# Altium schematic sheet 3_Connectors.SchDoc
size A4
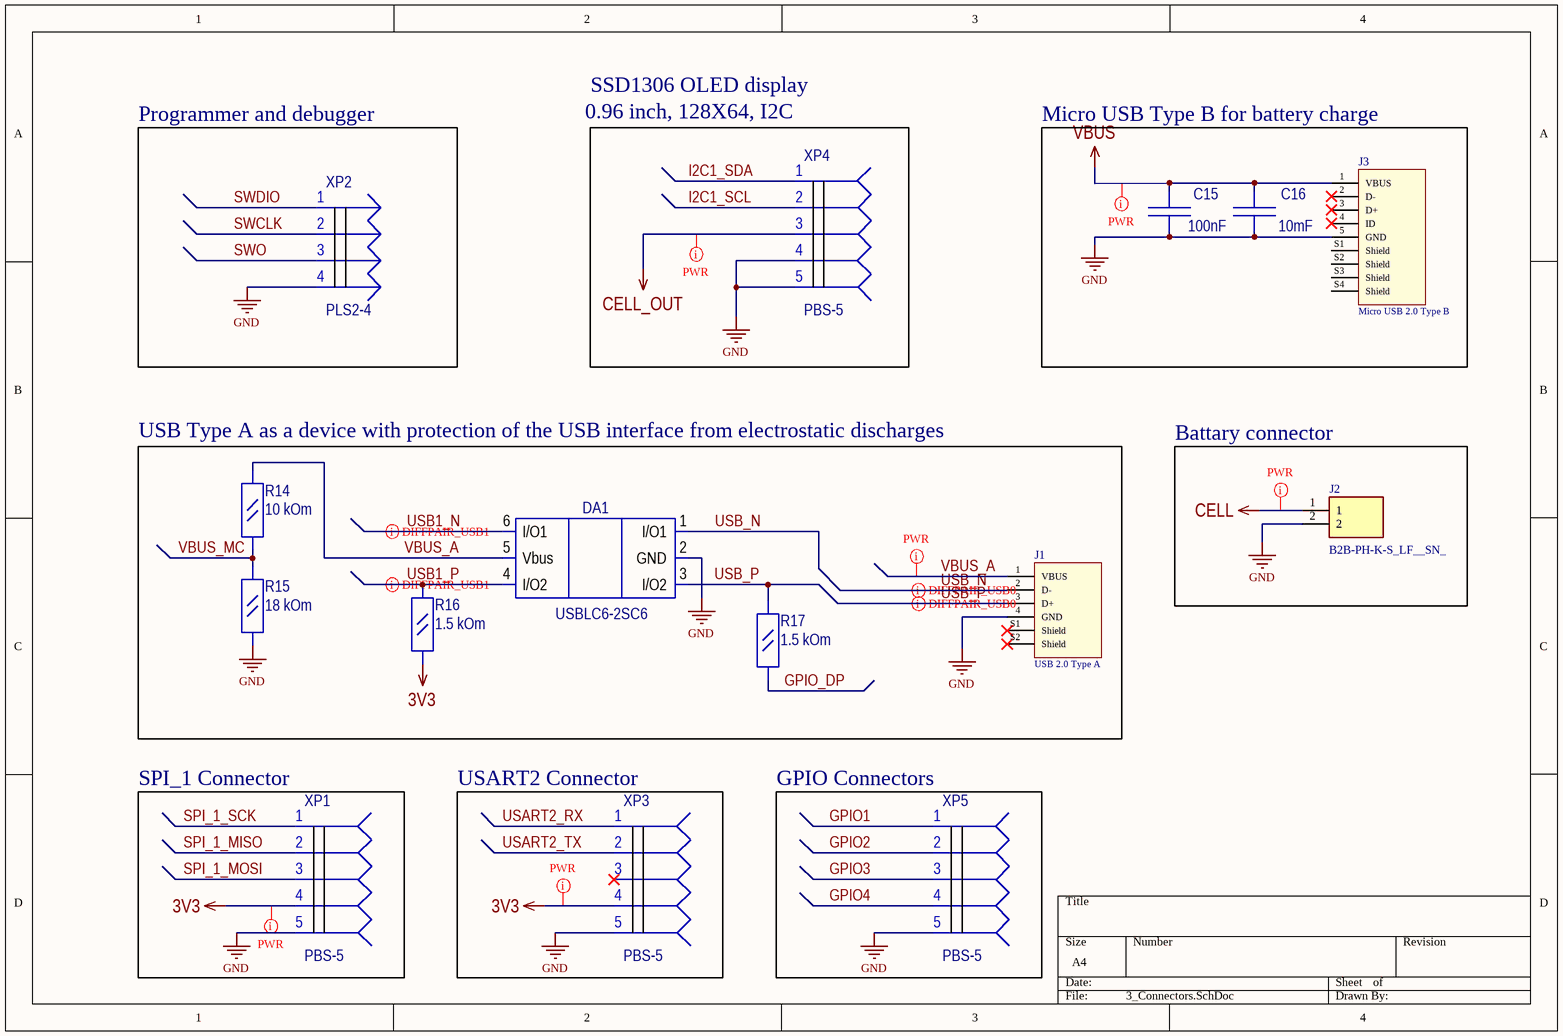
[diagram p0: 3_Connectors.SchDoc]

## Parts
C15  100nF  [C_0805]
C16  10mF  [C_0805]
DA1  USBLC6-2SC6  [SOT-23-6]
J1  USB 2.0 Type A  [61400416021]
J2  B2B-PH-K-S_LF__SN_  [SHDR2W50P0X200_1X2_590X450X600P]
J3  Micro USB 2.0 Type B  [629105136821]
R14  10 kOm  [R_0805]
R15  18 kOm  [R_0805]
R16  1.5 kOm  [R_0805]
R17  1.5 kOm  [R_0805]
XP1  PBS-5  [PBS-5]
XP2  PLS2-4  [PLS2-4]
XP3  PBS-5  [PBS-5]
XP4  PBS-5  [PBS-5]
XP5  PBS-5  [PBS-5]

## Blocks framed on the sheet
Programmer and debugger: XP2
Micro USB Type B for battery charge: C15 C16 J3
Battary connector: J2
SPI_1 Connector: XP1
USART2 Connector: XP3
GPIO Connectors: XP5

## Nets
3V3: R16.1 XP1.4 XP3.4
CELL: J2.1
CELL_OUT: XP4.3
GND: C15.1 C16.1 DA1.2(GND) J1.4(GND) J2.2 J3.5(GND) R15.1 XP1.5 XP2.4 XP3.5 XP4.4 XP4.5 XP5.5
VBUS: C15.2 C16.2 J3.1(VBUS)
GPIO1: XP5.1
GPIO2: XP5.2
GPIO3: XP5.3
GPIO4: XP5.4
GPIO_DP: R17.1
I2C1_SCL: XP4.2
I2C1_SDA: XP4.1
SPI_1_MISO: XP1.2
SPI_1_MOSI: XP1.3
SPI_1_SCK: XP1.1
SWCLK: XP2.2
SWDIO: XP2.1
SWO: XP2.3
USART2_RX: XP3.1
USART2_TX: XP3.2
USB1_N: DA1.6(I/O1)
USB1_P: DA1.4(I/O2) R16.2
USB_N: DA1.1(I/O1) J1.2(D-)
USB_P: DA1.3(I/O2) J1.3(D+) R17.2
VBUS_A: DA1.5(Vbus) J1.1(VBUS) R14.2
VBUS_MC: R14.1 R15.2

Not connected (* = marked no-connect by the designer): J1 S1(Shield)* S2(Shield)*; J3 2(D-)* 3(D+)* 4(ID)* S1(Shield) S2(Shield) S3(Shield) S4(Shield); XP3 3*

## Layout directives
differential pair; differential pair class USB1: USB1_N, USB1_P
differential pair; differential pair class USB0: USB_N, USB_P
net class PWR: 3V3, CELL, CELL_OUT, VBUS, VBUS_A

## Notes on the sheet
- SSD1306 OLED display
- 0.96 inch, 128X64, I2C
- (near R14) USB Type A as a device with protection of the USB interface from electrostatic discharges

## Library data of the parts
C15 C16 = C_0805
  C15: Value: 100nF
  C16: Value: 10mF
J1 = 61400416021: USB 2.0 Type A Horizontal THT WR-COM; Rated Current: 1.5 A; Gender: Female; ComponentLink1Description: Manufacturer; ComponentLink1URL: http://www.we-online.de; ComponentLink2Description: Datasheet; ComponentLink2URL: http://katalog.we-online.de/em/datasheet/61400416021.pdf; Part Number: 61400416021; Published Date: May 2018; Publisher: Wurth Elektronik; Orientation: Horizontal; Interface Type: USB 2.0 Type A; Operating Temperature: -40 to 105 degC; Mounting Technology: THT; Packaging: Tray
J2 = B2B-PH-K-S_LF__SN_: Connector; Manufacturer_Name: JST (JAPAN SOLDERLESS TERMINALS); Manufacturer_Part_Number: B2B-PH-K-S(LF)(SN); Datasheet Link: https://datasheet.lcsc.com/szlcsc/JST-Sales-America-B2B-PH-K-S-LF-SN_C131337.pdf; Height: 6mm; Arrow Part Number: B2B-PH-K-S(LF)(SN); Arrow Price/Stock: https://www.arrow.com/en/products/b2b-ph-k-s-lf-sn/jst-manufacturing
J3 = 629105136821: Micro USB 2.0 Type B Horizontal SMT 5 Contacts WR-COM; Rated Current: 1 A; Gender: Female; ComponentLink1Description: Manufacturer; ComponentLink1URL: http://www.we-online.de; ComponentLink2Description: Datasheet; ComponentLink2URL: http://katalog.we-online.de/em/datasheet/629105136821.pdf; Part Number: 629105136821; Published Date: May 2018; Publisher: Wurth Elektronik; Orientation: Horizontal; Interface Type: Micro USB 2.0 Type B; Operating Temperature: -40 to 85 degC; Mounting Technology: SMT; Packaging: Tape and Reel
R14 = R_0805: Value: 10 кOm
R15-R17 = R_0805
  R15: Value: 18 kOm
  R16 R17: Value: 1.5 kOm
DA1 = USBLC6-2SC6: HelpURL: https://static.chipdip.ru/lib/093/DOC001093117.pdf